# Altium schematic sheet MCA_DA_AudioMetter-V2.SchDoc
size A3
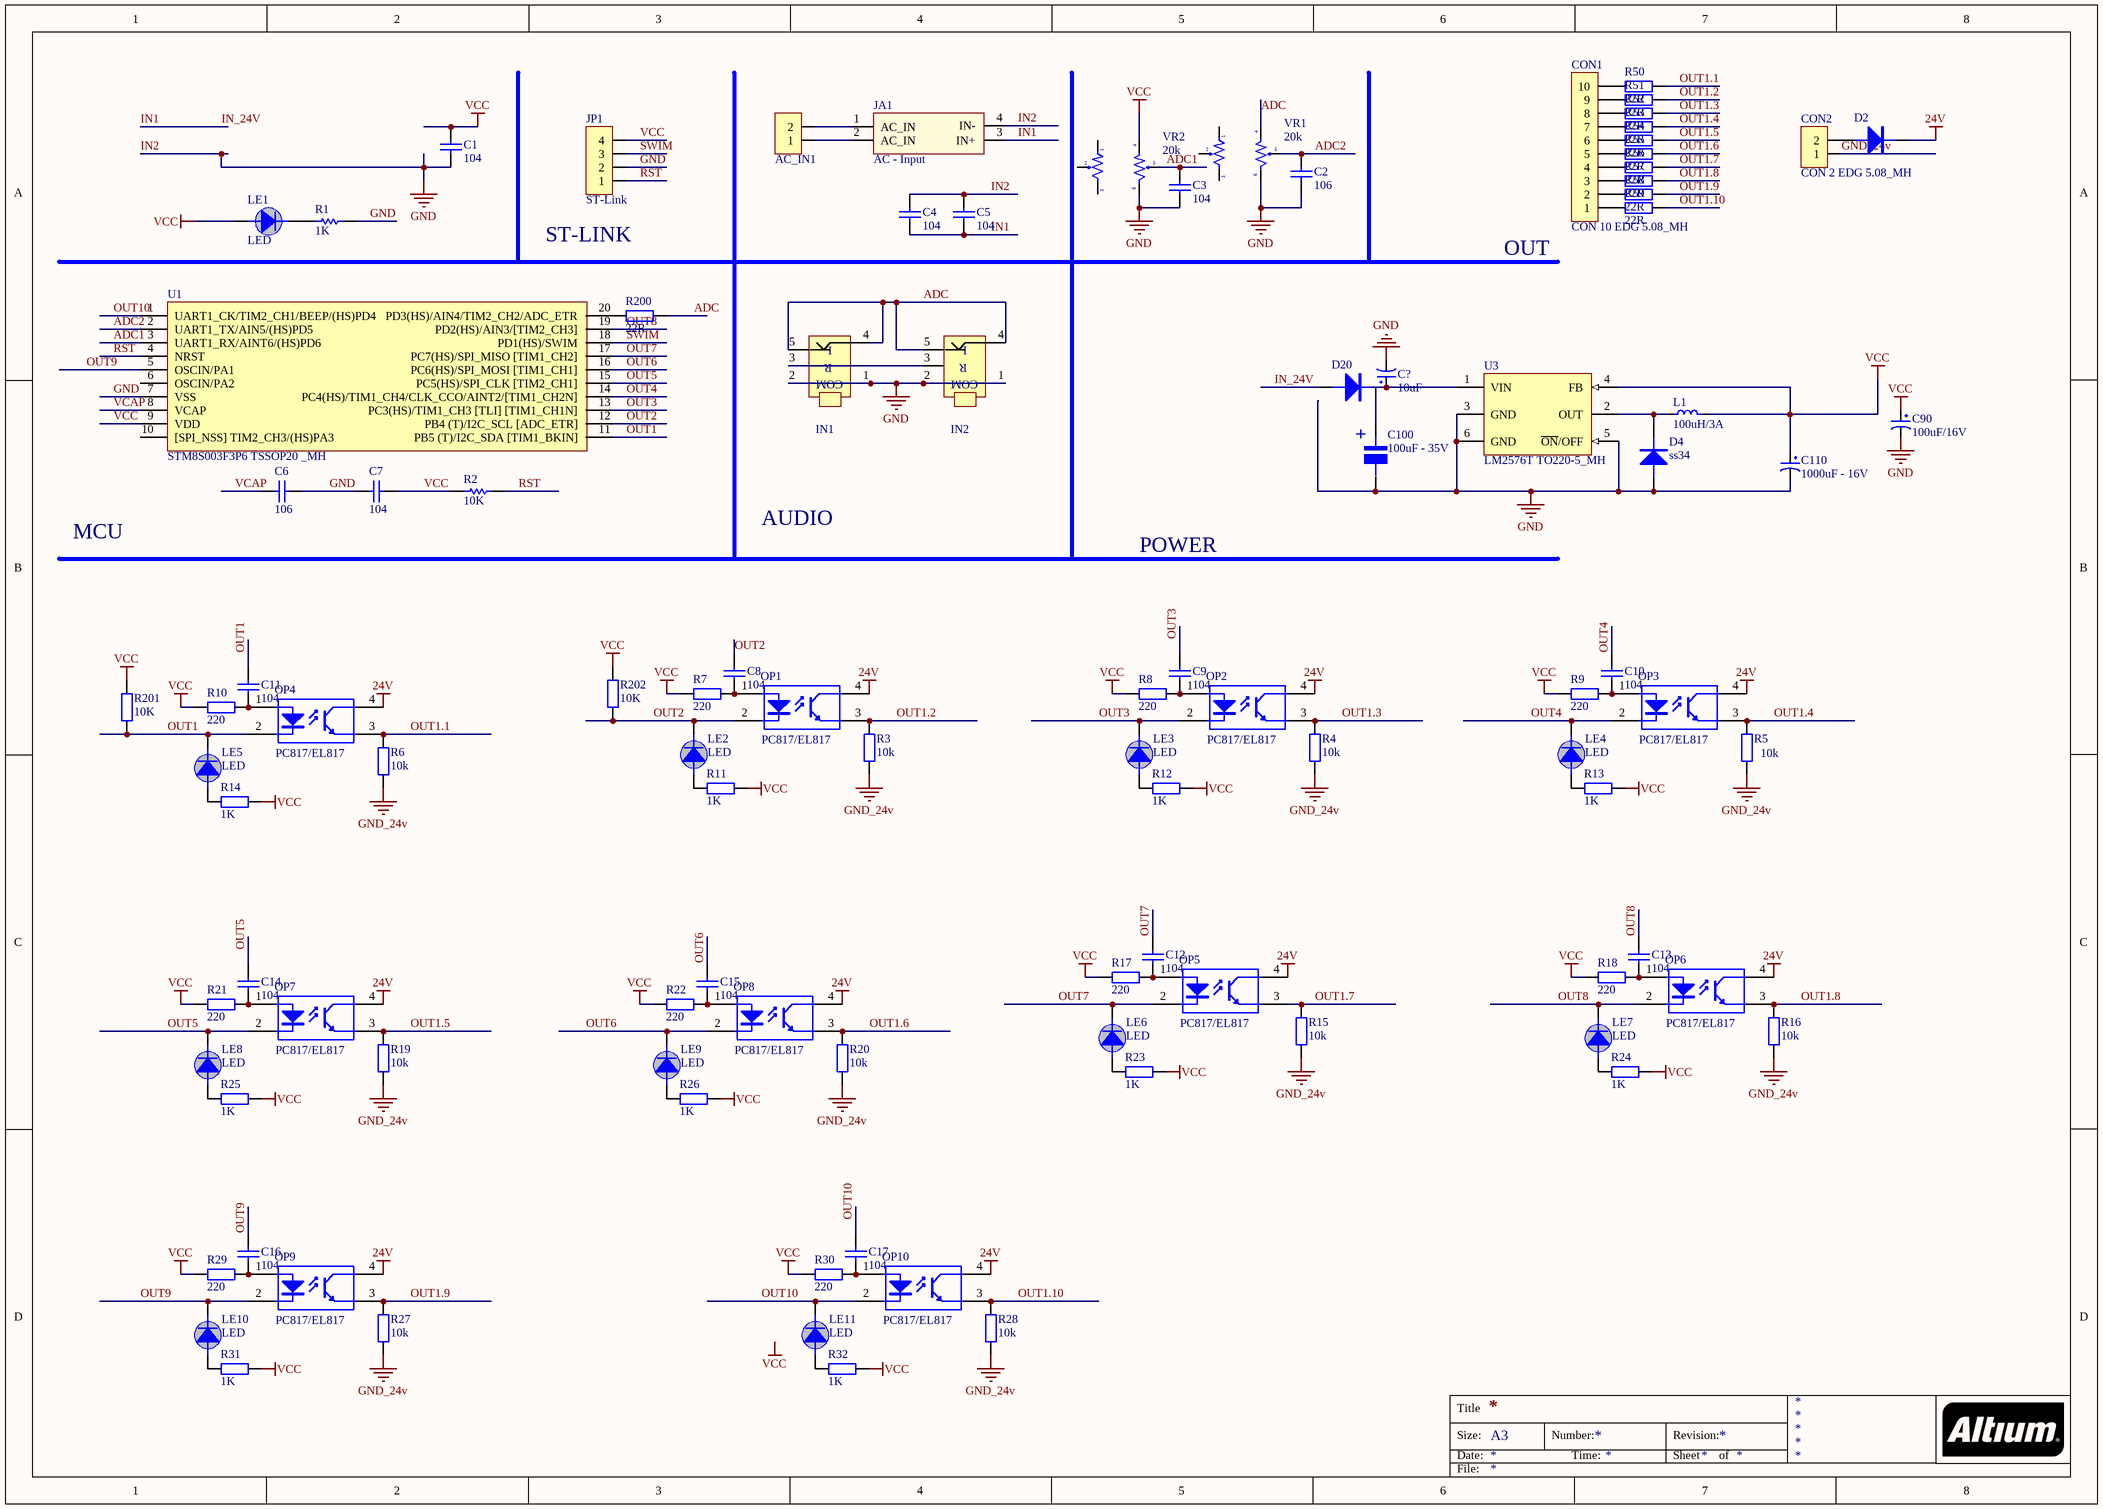
[diagram p0: MCA_DA_AudioMetter-V2.SchDoc]

## Parts
AC_IN1  CON 2 EDG 5.08_MH  [CON 2 EDG 5.08]  (value not drawn)
C1  104  [0805-CAP]
C2  value 106  [Tu-pico]  (hidden comment: Capacitor Ceramic)
C3  value 104  [Tu-pico]  (hidden comment: Capacitor Ceramic)
C4  104  [0805-CAP]
C5  104  [0805-CAP]
C6  106  [0805-CAP]
C7  104  [0805-CAP]
C8  value 104  [Tu 0805]  (hidden comment: Capacitor Ceramic)
C9  value 104  [Tu 0805]  (hidden comment: Capacitor Ceramic)
C10  value 104  [Tu 0805]  (hidden comment: Capacitor Ceramic)
C11  value 104  [Tu 0805]  (hidden comment: Capacitor Ceramic)
C12  value 104  [Tu 0805]  (hidden comment: Capacitor Ceramic)
C13  value 104  [Tu 0805]  (hidden comment: Capacitor Ceramic)
C14  value 104  [Tu 0805]  (hidden comment: Capacitor Ceramic)
C15  value 104  [Tu 0805]  (hidden comment: Capacitor Ceramic)
C16  value 104  [Tu 0805]  (hidden comment: Capacitor Ceramic)
C17  value 104  [Tu 0805]  (hidden comment: Capacitor Ceramic)
C90  100uF/16V  [TU_HOA(100uF/35V - 470uF/16V)]
C100  100uF - 35V  [TU HOA 8mm]
C110  1000uF - 16V  [TU HOA 1000uF25V]
C?  10uF  [CP2/5]
CON1  CON 10 EDG 5.08_MH  [Con 10 EDG 5.08]
CON2  CON 2 EDG 5.08_MH  [CON 2 EDG 5.08]
D2  SS34  [SOD80]  (value not drawn)
D4  ss34  [SS14]
D20  Diode 1N4001 DO41 1A 50V (DIP)_MH  [SS14]  (value not drawn)
IN1  Jack Audio 3.5MM PJ-327 5P_MH  [Jac audio 3.5]  (value not drawn)
IN2  Jack Audio 3.5MM PJ-327 5P_MH  [Jac audio 3.5]  (value not drawn)
JA1  AC - Input  [Nguon HiLink 5V]
JP1  ST-Link  [Jumper 4]
L1  100uH/3A  [L100uH3A]
LE1  LED  [LED_phi 3]
LE2  LED  [LED_phi 3]
LE3  LED  [LED_phi 3]
LE4  LED  [LED_phi 3]
LE5  LED  [LED_phi 3]
LE6  LED  [LED_phi 3]
LE7  LED  [LED_phi 3]
LE8  LED  [LED_phi 3]
LE9  LED  [LED_phi 3]
LE10  LED  [LED_phi 3]
LE11  LED  [LED_phi 3]
OP1  PC817/EL817 5V 5mA DIP _MH  [DIP4]  (value not drawn)
OP2  PC817/EL817 5V 5mA DIP _MH  [DIP4]  (value not drawn)
OP3  PC817/EL817 5V 5mA DIP _MH  [DIP4]  (value not drawn)
OP4  PC817/EL817 5V 5mA DIP _MH  [DIP4]  (value not drawn)
OP5  PC817/EL817 5V 5mA DIP _MH  [DIP4]  (value not drawn)
OP6  PC817/EL817 5V 5mA DIP _MH  [DIP4]  (value not drawn)
OP7  PC817/EL817 5V 5mA DIP _MH  [DIP4]  (value not drawn)
OP8  PC817/EL817 5V 5mA DIP _MH  [DIP4]  (value not drawn)
OP9  PC817/EL817 5V 5mA DIP _MH  [DIP4]  (value not drawn)
OP10  PC817/EL817 5V 5mA DIP _MH  [DIP4]  (value not drawn)
R1  1K  [0805-RES]
R2  10K  [0805-RES]
R3  10k  [Tro SMD 0805]
R4  10k  [Tro SMD 0805]
R5  10k  [Tro SMD 0805]
R6  10k  [Tro SMD 0805]
R7  220  [Tro SMD 0805]
R8  220  [Tro SMD 0805]
R9  220  [Tro SMD 0805]
R10  220  [Tro SMD 0805]
R11  1K  [TRO_VACH_ 1/4W]
R12  1K  [TRO_VACH_ 1/4W]
R13  1K  [TRO_VACH_ 1/4W]
R14  1K  [TRO_VACH_ 1/4W]
R15  10k  [Tro SMD 0805]
R16  10k  [Tro SMD 0805]
R17  220  [Tro SMD 0805]
R18  220  [Tro SMD 0805]
R19  10k  [Tro SMD 0805]
R20  10k  [Tro SMD 0805]
R21  220  [Tro SMD 0805]
R22  220  [Tro SMD 0805]
R23  1K  [TRO_VACH_ 1/4W]
R24  1K  [TRO_VACH_ 1/4W]
R25  1K  [TRO_VACH_ 1/4W]
R26  1K  [TRO_VACH_ 1/4W]
R27  10k  [Tro SMD 0805]
R28  10k  [Tro SMD 0805]
R29  220  [Tro SMD 0805]
R30  220  [Tro SMD 0805]
R31  1K  [TRO_VACH_ 1/4W]
R32  1K  [TRO_VACH_ 1/4W]
R50  22R  [Tro SMD 0805]
R51  22R  [Tro SMD 0805]
R52  22R  [Tro SMD 0805]
R53  22R  [Tro SMD 0805]
R54  22R  [Tro SMD 0805]
R55  22R  [Tro SMD 0805]
R56  22R  [Tro SMD 0805]
R57  22R  [Tro SMD 0805]
R58  22R  [Tro SMD 0805]
R59  22R  [Tro SMD 0805]
R200  22R  [Tro SMD 0805]
R201  10K  [Tro SMD 0805]
R202  10K  [Tro SMD 0805]
U1  STM8S003F3P6 TSSOP20 _MH  [TSSOP20]
U3  LM2576T TO220-5_MH  [LM2576t]
VR1  20k  [VR2-B]
VR2  20k  [VR2-B]

## Nets
24V: D2.2 OP1.4 OP2.4 OP3.4 OP4.4 OP5.4 OP6.4 OP7.4 OP8.4 OP9.4 OP10.4
GND: C1.1 C2.1 C3.1 C4.2 C5.2 C6.2 C7.1 C90.2 C100.2 C110.2 C?.2 D4.1 IN1.1 IN1.2 IN2.1 IN2.2 JA1.4(IN-) JP1.2 R1.1 U1.7(VSS) U3.3(GND) U3.5(~{ON}/OFF) U3.6(GND) VR1.6 VR2.6  [also labelled IN2]
GND_24v: CON2.1 R3.1 R4.1 R5.1 R6.1 R15.1 R16.1 R19.1 R20.1 R27.1 R28.1
VCC: C1.2 C7.2 C90.1 C110.1 JP1.4 L1.2 LE1.1(anot) R2.2 R7.1 R8.1 R9.1 R10.1 R11.2 R12.2 R13.2 R14.2 R17.1 R18.1 R21.1 R22.1 R23.2 R24.2 R25.2 R26.2 R29.1 R30.1 R31.2 R32.2 R201.1 R202.1 U1.9(VDD) U3.4(FB) VR2.4
ADC: IN1.4 IN1.5 IN2.4 IN2.5 R200.2 VR1.4
ADC1: C3.2 U1.3(UART1_RX/AINT6/(HS)PD6) VR2.5
ADC2: C2.2 U1.2(UART1_TX/AIN5/(HS)PD5) VR1.5
IN1: C4.1 C5.1 D20.1 JA1.3(IN+)  [also labelled IN_24V]
OUT1: C11.2 LE5.2(Katot) OP4.2 R201.2 U1.11(PB5_(T)/I2C_SDA_[TIM1_BKIN])
OUT1.1: OP4.3 R6.2 R50.2
OUT1.2: OP1.3 R3.2 R51.2
OUT1.3: OP2.3 R4.2 R52.2
OUT1.4: OP3.3 R5.2 R53.2
OUT1.5: OP7.3 R19.2 R54.2
OUT1.6: OP8.3 R20.2 R55.2
OUT1.7: OP5.3 R15.2 R56.2
OUT1.8: OP6.3 R16.2 R57.2
OUT1.9: OP9.3 R27.2 R58.2
OUT1.10: OP10.3 R28.2 R59.2
OUT2: C8.2 LE2.2(Katot) OP1.2 R202.2 U1.12(PB4_(T)/I2C_SCL_[ADC_ETR])
OUT3: C9.2 LE3.2(Katot) OP2.2 U1.13(PC3(HS)/TIM1_CH3_[TLI]_[TIM1_CH1N])
OUT4: C10.2 LE4.2(Katot) OP3.2 U1.14(PC4(HS)/TIM1_CH4/CLK_CCO/AINT2/[TIM1_CH2N])
OUT5: C14.2 LE8.2(Katot) OP7.2 U1.15(PC5(HS)/SPI_CLK_[TIM2_CH1])
OUT6: C15.2 LE9.2(Katot) OP8.2 U1.16(PC6(HS)/SPI_MOSI_[TIM1_CH1])
OUT7: C12.2 LE6.2(Katot) OP5.2 U1.17(PC7(HS)/SPI_MISO_[TIM1_CH2])
OUT8: C13.2 LE7.2(Katot) OP6.2 U1.19(PD2(HS)/AIN3/[TIM2_CH3])
OUT9: C16.2 LE10.2(Katot) OP9.2 U1.5(OSCIN/PA1)
OUT10: C17.2 LE11.2(Katot) OP10.2 U1.1(UART1_CK/TIM2_CH1/BEEP/(HS)PD4)
RST: JP1.1 R2.1 U1.4(NRST)
SWIM: JP1.3 U1.18(PD1(HS)/SWIM)
VCAP: C6.1 U1.8(VCAP)
NetAC_IN1_1: AC_IN1.1 JA1.2(AC_IN)
NetAC_IN1_2: AC_IN1.2 JA1.1(AC_IN)
NetC8_1: C8.1 OP1.1 R7.2
NetC9_1: C9.1 OP2.1 R8.2
NetC10_1: C10.1 OP3.1 R9.2
NetC11_1: C11.1 OP4.1 R10.2
NetC12_1: C12.1 OP5.1 R17.2
NetC13_1: C13.1 OP6.1 R18.2
NetC14_1: C14.1 OP7.1 R21.2
NetC15_1: C15.1 OP8.1 R22.2
NetC16_1: C16.1 OP9.1 R29.2
NetC17_1: C17.1 OP10.1 R30.2
NetC100_1: C100.1 C?.1 D20.2 U3.1(VIN)
NetCON1_1: CON1.1 R59.1
NetCON1_2: CON1.2 R58.1
NetCON1_3: CON1.3 R57.1
NetCON1_4: CON1.4 R56.1
NetCON1_5: CON1.5 R55.1
NetCON1_6: CON1.6 R54.1
NetCON1_7: CON1.7 R53.1
NetCON1_8: CON1.8 R52.1
NetCON1_9: CON1.9 R51.1
NetCON1_10: CON1.10 R50.1
NetCON2_2: CON2.2 D2.1
NetD4_2: D4.2 L1.1 U3.2(OUT)
NetIN1_3: IN1.3 IN2.3
NetLE1_2: LE1.2(Katot) R1.2
NetLE2_1: LE2.1(anot) R11.1
NetLE3_1: LE3.1(anot) R12.1
NetLE4_1: LE4.1(anot) R13.1
NetLE5_1: LE5.1(anot) R14.1
NetLE6_1: LE6.1(anot) R23.1
NetLE7_1: LE7.1(anot) R24.1
NetLE8_1: LE8.1(anot) R25.1
NetLE9_1: LE9.1(anot) R26.1
NetLE10_1: LE10.1(anot) R31.1
NetLE11_1: LE11.1(anot) R32.1
NetR200_1: R200.1 U1.20(PD3(HS)/AIN4/TIM2_CH2/ADC_ETR)

Not connected (* = marked no-connect by the designer): U1 6(OSCIN/PA2) 10([SPI_NSS]_TIM2_CH3/(HS)PA3); VR1 1 2 3; VR2 1 2 3

## Notes on the sheet
- ST-LINK
- OUT
- MCU
- AUDIO
- POWER
- Labels drawn without touching a wire or pin: VCC
- Title
- Size:
- Date:
- A3
- Number:
- Time:
- Revision:
- Sheet
- of
- File:
- (in symbol Jack Audio 3.5MM PJ-327 5P_MH) L; R; COM
- (in symbol PC817/EL817 5V 5mA DIP _MH) PC817/EL817
- (in symbol Tu Hoa 100uF 35V) +

## Library data of the parts
AC_IN1 CON2 = CON 2 EDG 5.08_MH: CON 2 EDG 5.08 (xanh cong)
C1 C4-C7 = CAP SMD: Capacitor; Value: 33p; Published: 8-Jun-2000; LatestRevisionDate: 17-Jul-2002; LatestRevisionNote: Re-released for DXP Platform.; PackageReference: RAD-0.3; Publisher: Altium Limited
C2 C3 C8-C17 = CapCeramic: Capacitor; Published: 8-Jun-2000; LatestRevisionDate: 17-Jul-2002; LatestRevisionNote: Re-released for DXP Platform.; PackageReference: RAD-0.3; Publisher: Altium Limited
C90 = TU_HOA_100uF_16V_MH: TU_HOA_100uF_16V; Value: 100uF/35V/50V; Description 1: 1000uF/6,3V - 470uF/16V - 330uF - 25V; Description 2: 220uF/35V - 100uF/50V - 63V - 4,7uF/200V; Description 3: 22uF => 33uF100V - 3,3uF => 4,7uF/250V; Description 4: 2,2uF =>3,3uF/350 - 2,2uF/400V - 1uF/450V
C100 = Tu Hoa 100uF 35V: Cắm; Ten_Linh_Kien: Tụ Hóa 100uF 35V 8x11MM; Ma_Hang: MH002807; Don_Vi: Con; Ghi_Chu: *; Kieu_Chan: *; Chung_Loai: Cắm
C110 = Tu Nhom 1000uF - 16V: Dán; Ten_Linh_Kien: Tụ Nhôm 1000uF 16V 10x10MM; Ma_Hang: MH004419; Don_Vi: Con; Kieu_Chan: *; Ghi_Chu: *; Chung_Loai: Dán
C? = TU_HOA_47uF_100V_MH: Value: 10uF/50V; Description 1: 10 => 220uF/6,3V/10V - 10uF => 100uF/16V; Description 2: 0,1uF => 33uF/50V - 10uF => 22uF/63V; Description 3: 0,47uF => 10uF/100V
CON1 = CON 10 EDG 5.08_MH: CON 10 EDG 5.08 (xanh cong)
D2 = Diode 1N4148 SOD80 450mA 100V ( LL34 1N4148 SMD)_MH: Diode 1N4148 SOD80 450mA 100V ( LL34 1N4148 SMD)
D4 = Diode 1N4007 1A_MH: Diode 1N4007 1A
D20 = Diode 1N4001 DO41 1A 50V (DIP)_MH: Diode 1N4001 DO41 1A 50V (DIP)
JA1 = NGUON_KHONGVO: Value: AC - Input
JP1 = Jump 4_MH: Jump 4P 2.54
L1 = L100uH3A: Cuon cam
LE1-LE11 = LED_DIP_3MM
R1 R2 = RESSMD
R3-R32 R50-R59 R200-R202 = TRO_SMD_0805_MH: TRO_SMD_0805
U3 = LM2576T TO220-5_MH: SIMPLE SWITCHER; 3A Step-Down Voltage Regulator; PartNumber: LM2576T-5.0; Manufacturer: National Semiconductor; PackageTopMarking: NSUZXYTT*LM2576T*-5.0 P+; PowerWise: N; FirstPublished: 4-Dec-2008; DatasheetVersion: Aug-2004; PackageVersion: revJ, Jan-1992; PackageReference: T05A; Publisher: Altium Limited; PackageDescription: TO-220, Molded, 5 Lead, Straight; CompType: Switcher; RoHS: O; PinCount: 5; DigiKeyPartNumber: LM2576T-5.0-ND; Code_JEDEC: TO-220-AB; ComponentLink1Description: LM2576 Datasheet; ComponentLink1URL: http://www.national.com/ds/LM/LM2576.pdf; ComponentLink2Description: LM2576 Web Page; ComponentLink2URL: http://www.national.com/pf/LM/LM2576.html; ComponentLink3Description: T05A Package Page; ComponentLink3URL: http://www.national.com/packaging/folders/t05a.html
VR1 VR2 = Triet Ap Doi 20k_MH: Triet Ap Doi 20k